# Altium project MB1355C.PrjPcb
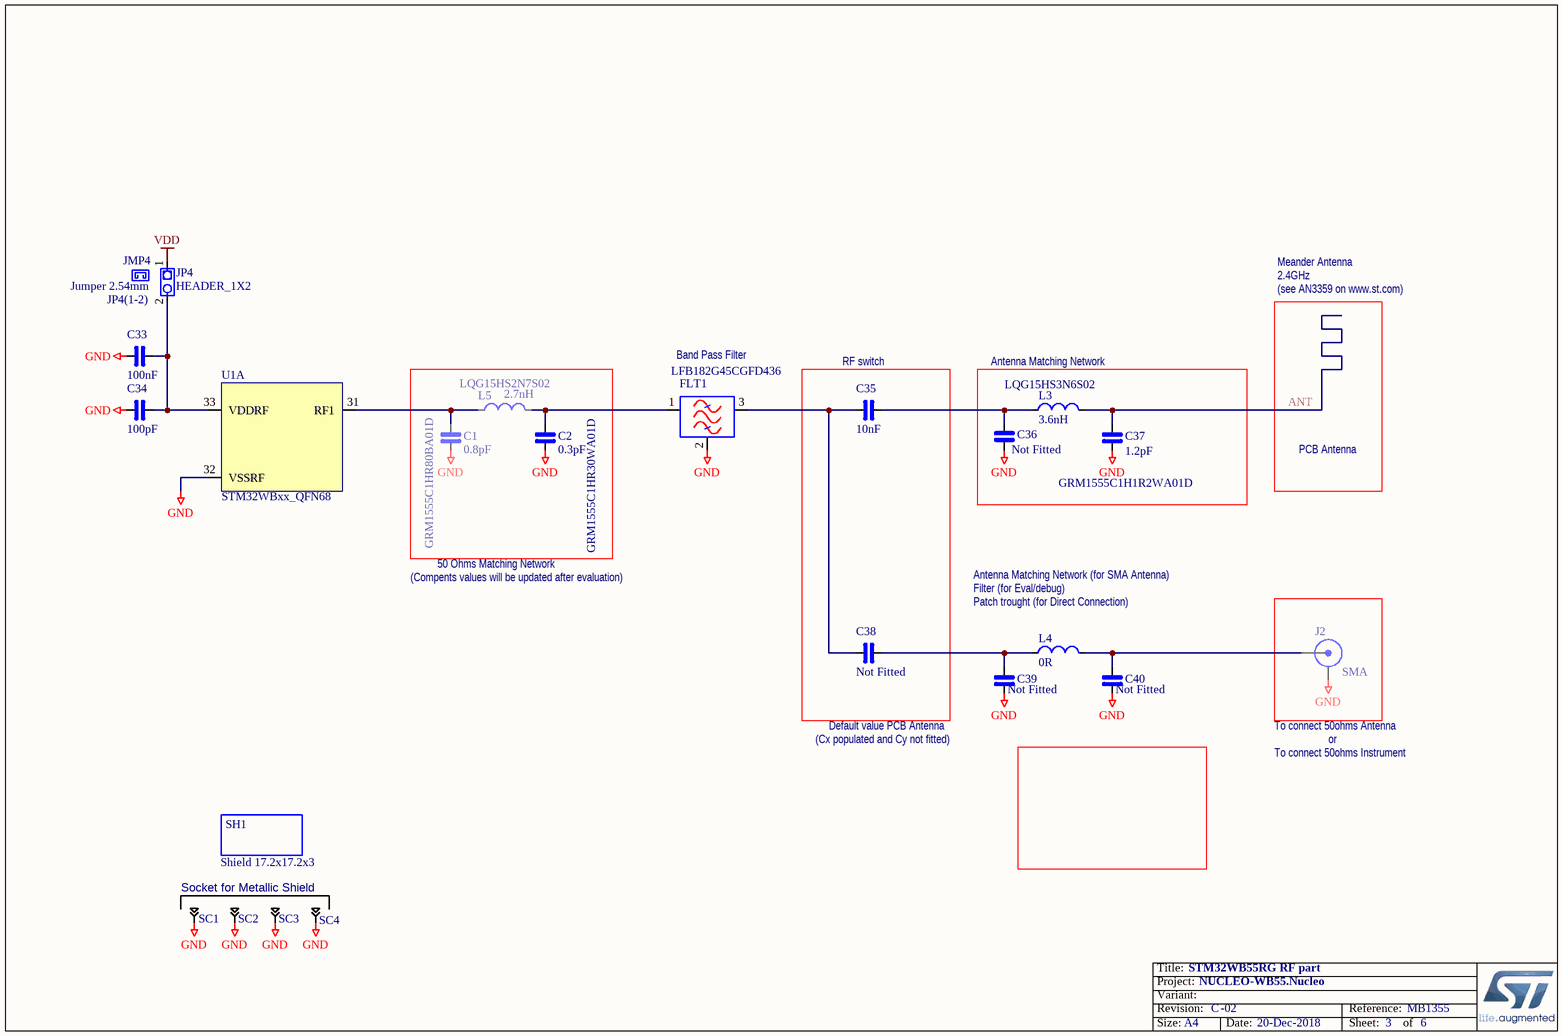
[diagram p0: RF.SchDoc]
Board_Reference: MB1355; Board_PCB_Revision: C; Board_Name: NUCLEO-WB55.Nucleo; Board_Document_Date: 20-Dec-2018; Board_Assembly_Revision: 02
2 sheets, 53 parts. Net scope: flat (ports and power ports of the same name join across sheets).
Board file: Nucleo_Dory_QFN68.PcbDoc
Sheets:
  RF.SchDoc
  Extension_CN.SchDoc

## Sheet RF.SchDoc: STM32WB55RG RF part
size A4; Author: PhA; SheetNumber: 3; SheetTotal: 6

### Parts
C1  0.8pF  REF: GRM1555C1HR80BA01D  [0402_CAP_NPOL]
C2  0.3pF  REF: GRM1555C1HR30WA01D  [0402_CAP_NPOL]
C33  100nF  [0402_CAP_NPOL]
C34  100pF  [0402_CAP_NPOL]
C35  10nF  [0402_CAP_NPOL]
C36  Fitted: Not Fitted  [0402_CAP_NPOL]
C37  1.2pF  Ref: GRM1555C1H1R2WA01D  [0402_CAP_NPOL]
C38  Fitted: Not Fitted  [0402_CAP_NPOL]
C39  Fitted: Not Fitted  [0402_CAP_NPOL]
C40  Fitted: Not Fitted  [0402_CAP_NPOL]
FLT1  LFB182G45CGFD436  [LFB182G45CGFD436]
J2  SMA  [SMA_T_9.52_NF]
JMP4  Jumper 2.54mm  default: JP4(1-2)  [Jumper 2.54mm BLACK]
JP4  HEADER_1X2  [Header M 1x2x2.54 TH V]
L3  3.6nH  Ref: LQG15HS3N6S02  [0402_COIL]
L4  0R  [0402_COIL]
L5  2.7nH  Ref: LQG15HS2N7S02  [0402_COIL]
SC1  Shield Clip_A 3.9x1.1x1.28  [Shield Clip_A 3.9x1.1x1.28]  (value not drawn)
SC2  Shield Clip_A 3.9x1.1x1.28  [Shield Clip_A 3.9x1.1x1.28]  (value not drawn)
SC3  Shield Clip_A 3.9x1.1x1.28  [Shield Clip_A 3.9x1.1x1.28]  (value not drawn)
SC4  Shield Clip_A 3.9x1.1x1.28  [Shield Clip_A 3.9x1.1x1.28]  (value not drawn)
SH1  Shield 17.2x17.2x3  [Shield 17.2x17.2x3]
U1  STM32WBxx_QFN68  [VFQFPN68_8x8x0.1_p0.4]  (part A of 5)

### Blocks framed on the sheet
RF switch: C35 C38
Antenna Matching Network: C36 C37 L3

### Nets
GND: C1.1 C2.1 C33.1 C34.1 C36.2 C37.1 C39.1 C40.1 FLT1.2(GND) J2.2(Y) SC1.1 SC2.1 SC3.1 SC4.1 U1.32(VSSRF)
VDD: JP4.1
ANT: C37.2 L3.2
NetC1_2: C1.2 L5.1 U1.31(RF1)
NetC2_2: C2.2 FLT1.1(I/O) L5.2
NetC33_2: C33.2 C34.2 JP4.2 U1.33(VDDRF)
NetC35_1: C35.1 C38.1 FLT1.3(I/O)
NetC35_2: C35.2 C36.1 L3.1
NetC38_2: C38.2 C39.2 L4.1
NetC40_2: C40.2 J2.1(X) L4.2

### Notes on the sheet
- Meander Antenna
- 2.4GHz
- (see AN3359 on www.st.com)
- (near FLT1) Band Pass Filter
- PCB Antenna
- (Compents values will be updated after evaluation)
- 50 Ohms Matching Network
- Antenna Matching Network (for SMA Antenna)
- Filter (for Eval/debug)
- Patch trought (for Direct Connection)
- (near C39) (Cx populated and Cy not fitted)
- Default value PCB Antenna
- To connect 50ohms Antenna
- To connect 50ohms Instrument
- or
- Socket for Metallic Shield
- Title:
- Project:
- Size:
- Revision:
- Variant:
- A4
- -
- Date:
- Reference:
- Sheet:
- of

### Library data of the parts
C1 C2 C33 C34 C36-C40 = CAP_NPOL: Capacitor_not polarized
  C37: Fitted: Fitted
C35 = CAP_NPOL: Capacitor_not polarized; Ref: Murata GRM155R71H103KA88
FLT1 = LFB182G45CGFD436: Band Pass Filter Murata LFB182G45CGFD436
JP4 = HEADER_1X2_L
L3-L5 = INDUCTOR_SMD_STDL
SC1-SC4 = Shield Clip_A 3.9x1.1x1.28: Harwin S0951-46R
SH1 = Shield

## Sheet Extension_CN.SchDoc: Arduino/Morphos extension connectors
size A4; Author: Ph.A; SheetNumber: 4; SheetTotal: 6
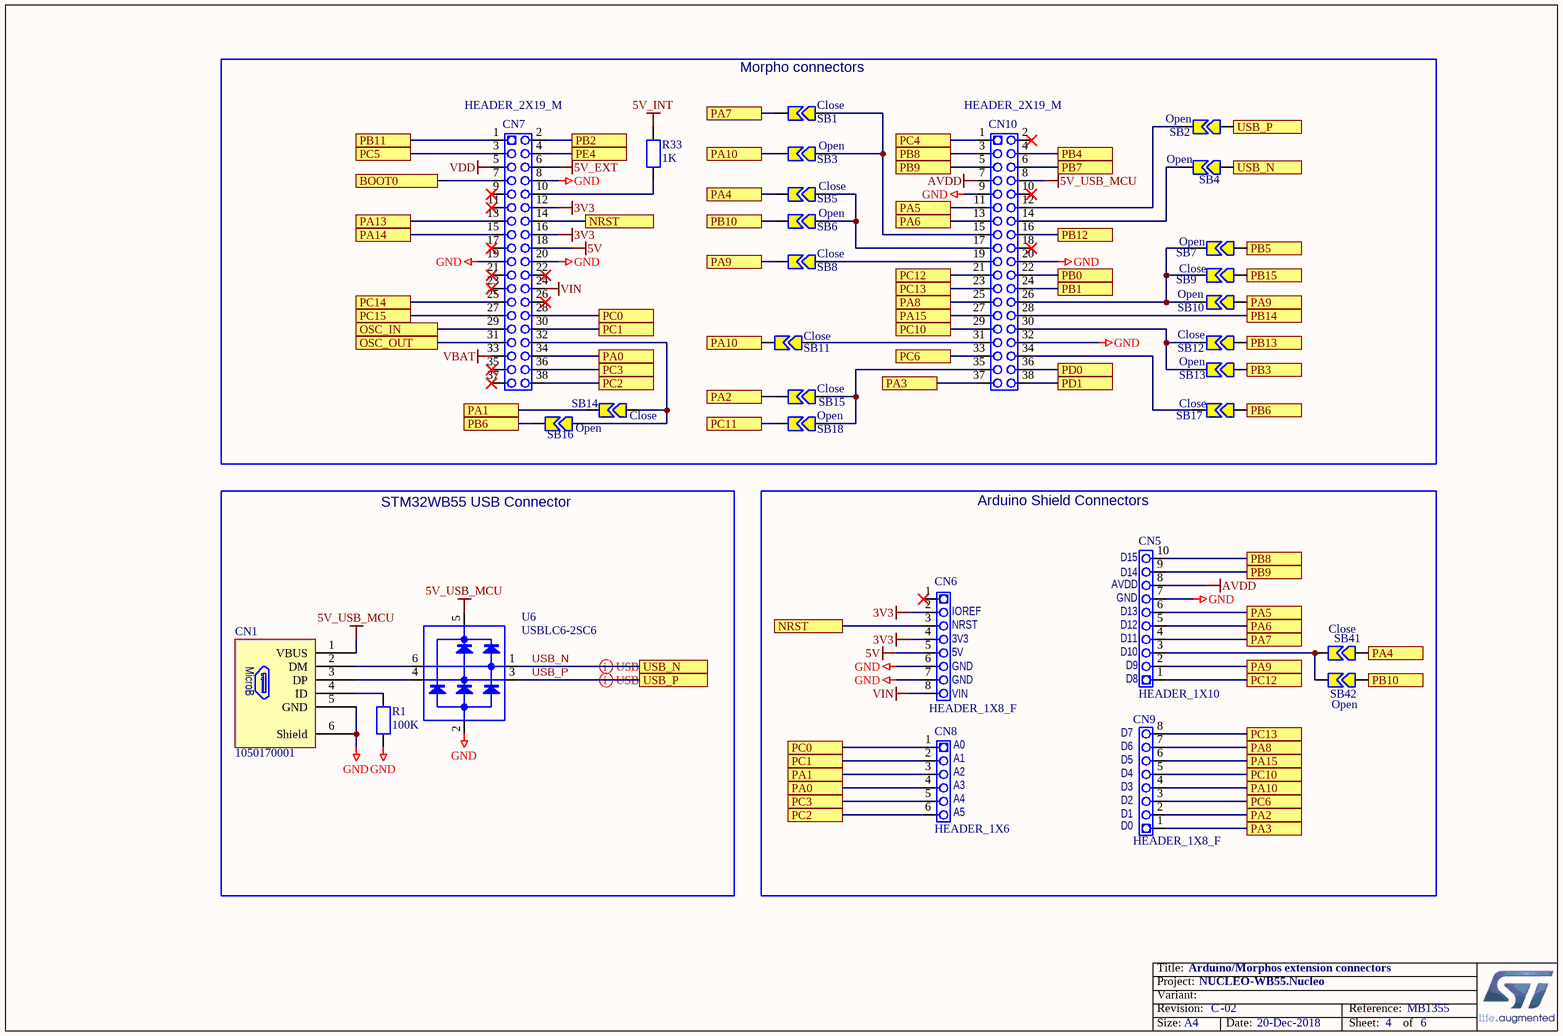
[diagram p1: Extension_CN.SchDoc]

### Parts
CN1  1050170001  [USBMICROB_MOLEX_105017-0001_H2P90]
CN5  HEADER_1X10  [Header F 1x10x2.54 TH V]
CN6  HEADER_1X8_F  [Header F 1x8x2.54 TH V]
CN7  HEADER_2X19_M  [Header M 2x19x2.54 TH M_top + M_bottom]
CN8  HEADER_1X6  [Header F 1x6x2.54 TH V]
CN9  HEADER_1X8_F  [Header F 1x8x2.54 TH V]
CN10  HEADER_2X19_M  [Header M 2x19x2.54 TH M_top + M_bottom]
R1  100K  [0402_RES]
R33  1K  [0402_RES]
SB1  Close  [SB-tiny]
SB2  Open  [SB-tiny]
SB3  Open  [SB-tiny]
SB4  Open  [SB-tiny]
SB5  Close  [SB-tiny]
SB6  Open  [SB-tiny]
SB7  Open  [SB-tiny]
SB8  Close  [SB-tiny]
SB9  Close  [SB-tiny]
SB10  Open  [SB-tiny]
SB11  Close  [SB-tiny]
SB12  Close  [SB-tiny]
SB13  Open  [SB-tiny]
SB14  Close  [SB-tiny]
SB15  Close  [SB-tiny]
SB16  Open  [SB-tiny]
SB17  Close  [SB-tiny]
SB18  Open  [SB-tiny]
SB41  Close  [SB-tiny]
SB42  Open  [SB-tiny]
U6  USBLC6-2SC6  [SOT23-6]

### Blocks framed on the sheet
Morpho connectors: CN7 CN10 R33 SB1-SB18
STM32WB55 USB Connector: CN1 R1 U6
Arduino Shield Connectors: CN5 CN6 CN8 CN9 SB41 SB42

### Ports
BOOT0, NRST, OSC_IN, OSC_OUT, PA0, PA1, PA2, PA3, PA4, PA5, PA6, PA7, PA8, PA9, PA10, PA13, PA14, PA15, PB0, PB1, PB2, PB3, PB4, PB5, PB6, PB7, PB8, PB9, PB10, PB11, PB12, PB13, PB14, PB15, PC0, PC1, PC2, PC3, PC4, PC5, PC6, PC10, PC11, PC12, PC13, PC14, PC15, PD0, PD1, PE4, USB_N, USB_P

### Nets
3V3: CN6.2 CN6.4 CN7.12 CN7.16
5V: CN6.5 CN7.18
5V_EXT: CN7.6
5V_INT: R33.2
5V_USB_MCU: CN1.1(VBUS) CN10.8 U6.5
AVDD: CN5.8 CN10.7
GND: CN1.5(GND) CN1.6(Shield) CN5.7 CN6.6 CN6.7 CN7.8 CN7.19 CN7.20 CN10.9 CN10.20 CN10.32 R1.1 U6.2
VBAT: CN7.33
VDD: CN7.5
VIN: CN6.8 CN7.24
BOOT0: CN7.7 ; port BOOT0
NRST: CN6.3 CN7.14 ; port NRST
OSC_IN: CN7.29 ; port OSC_IN
OSC_OUT: CN7.31 ; port OSC_OUT
PA0: CN7.34 CN8.4 ; port PA0
PA1: CN8.3 SB14.2 ; port PA1
PA2: CN9.2 SB15.2 ; port PA2
PA3: CN9.1 CN10.37 ; port PA3
PA4: SB5.2 SB41.1 ; port PA4
PA5: CN5.6 CN10.11 ; port PA5
PA6: CN5.5 CN10.13 ; port PA6
PA7: CN5.4 SB1.2 ; port PA7
PA8: CN9.7 CN10.25 ; port PA8
PA9: CN5.2 SB8.2 SB10.1 ; port PA9
PA10: CN9.4 SB3.2 SB11.2 ; port PA10
PA13: CN7.13 ; port PA13
PA14: CN7.15 ; port PA14
PA15: CN9.6 CN10.27 ; port PA15
PB0: CN10.22 ; port PB0
PB1: CN10.24 ; port PB1
PB2: CN7.2 ; port PB2
PB3: SB13.1 ; port PB3
PB4: CN10.4 ; port PB4
PB5: SB7.1 ; port PB5
PB6: SB16.2 SB17.1 ; port PB6
PB7: CN10.6 ; port PB7
PB8: CN5.10 CN10.3 ; port PB8
PB9: CN5.9 CN10.5 ; port PB9
PB10: SB6.2 SB42.1 ; port PB10
PB11: CN7.1 ; port PB11
PB12: CN10.16 ; port PB12
PB13: SB12.1 ; port PB13
PB14: CN10.28 ; port PB14
PB15: SB9.1 ; port PB15
PC0: CN7.28 CN8.1 ; port PC0
PC1: CN7.30 CN8.2 ; port PC1
PC2: CN7.38 CN8.6 ; port PC2
PC3: CN7.36 CN8.5 ; port PC3
PC4: CN10.1 ; port PC4
PC5: CN7.3 ; port PC5
PC6: CN9.3 CN10.33 ; port PC6
PC10: CN9.5 CN10.29 ; port PC10
PC11: SB18.2 ; port PC11
PC12: CN5.1 CN10.21 ; port PC12
PC13: CN9.8 CN10.23 ; port PC13
PC14: CN7.25 ; port PC14
PC15: CN7.27 ; port PC15
PD0: CN10.36 ; port PD0
PD1: CN10.38 ; port PD1
PE4: CN7.4 ; port PE4
USB_N: SB4.1 U6.1 ; port USB_N
USB_P: SB2.1 U6.3 ; port USB_P
NetCN1_2: CN1.2(DM) U6.6
NetCN1_3: CN1.3(DP) U6.4
NetCN1_4: CN1.4(ID) R1.2
NetCN5_3: CN5.3 SB41.2 SB42.2
NetCN7_10: CN7.10 R33.1
NetCN7_32: CN7.32 SB14.1 SB16.1
NetCN10_12: CN10.12 SB2.2
NetCN10_14: CN10.14 SB4.2
NetCN10_15: CN10.15 SB1.1 SB3.1
NetCN10_17: CN10.17 SB5.1 SB6.1
NetCN10_19: CN10.19 SB8.1
NetCN10_26: CN10.26 SB7.2 SB9.2 SB10.2
NetCN10_30: CN10.30 SB12.2 SB13.2
NetCN10_31: CN10.31 SB11.1
NetCN10_34: CN10.34 SB17.2
NetCN10_35: CN10.35 SB15.1 SB18.1

Not connected (* = marked no-connect by the designer): CN6 1*; CN7 9* 11* 17* 21* 22* 23* 26* 35* 37*; CN10 2* 10* 18*

### Layout directives
differential pair; net class DIFF90: USB_N, USB_P

### Notes on the sheet
- (near CN5) D14
- (near CN5) D15
- (near CN6) 3V3
- (near CN6) NRST
- (near CN6) IOREF
- (near CN5) AVDD
- (near CN5) GND
- (near CN5) D10
- (near CN5) D11
- (near CN5) D12
- (near CN5) D13
- (near CN6) GND
- (near CN6) VIN
- (near CN6) 5V
- (near CN5) D9
- (near CN5) D8
- (near CN8) A0
- (near CN8) A1
- (near CN8) A2
- (near CN8) A3
- (near CN9) D3
- (near CN9) D4
- (near CN9) D5
- (near CN9) D6
- (near CN9) D7
- (near CN8) A5
- (near CN8) A4
- (near CN9) D0
- (near CN9) D1
- (near CN9) D2
- Title:
- Project:
- Size:
- Revision:
- Variant:
- -
- Date:
- Reference:
- Sheet:
- of
- (in symbol 1050170001) MicroB

### Library data of the parts
CN1 = 1050170001: USB-MICRO-B, 1050170001, SMT, MOLEX; Fitted: YES; Ordered_By: Subcon; ECCN_US/EU: n/a; Manuf_1: MOLEX; Manuf_Part_1: 1050170001; Distrib: DIGIKEY; Value: 1050170001; Order_Code: *
CN6 = HEADER_1X8: Specific Function: Arduino Power
CN7 = HEADER_2X19: Specific Function: Morpho CN7
CN9 = HEADER_1X8: Specific Function: Arduino Digital 1
CN10 = HEADER_2X19: Specific Function: Morpho CN10
R1 R33 = RES: Resistor
SB1-SB18 SB41 SB42 = Strap2: Solder Jumper; Solder: YES; Published: 24-Mar-1999; Revision: July-2002: Re-released for DXP Platform.; Publisher: Altium Limited
U6 = USBLC6-2

## Nets that join several sheets
GND: RF (15 pins), Extension_CN (13 pins)
VDD: RF (JP4.1), Extension_CN (CN7.5)